# EAGLE design 403_led_bar (EAGLE 7.6.0)
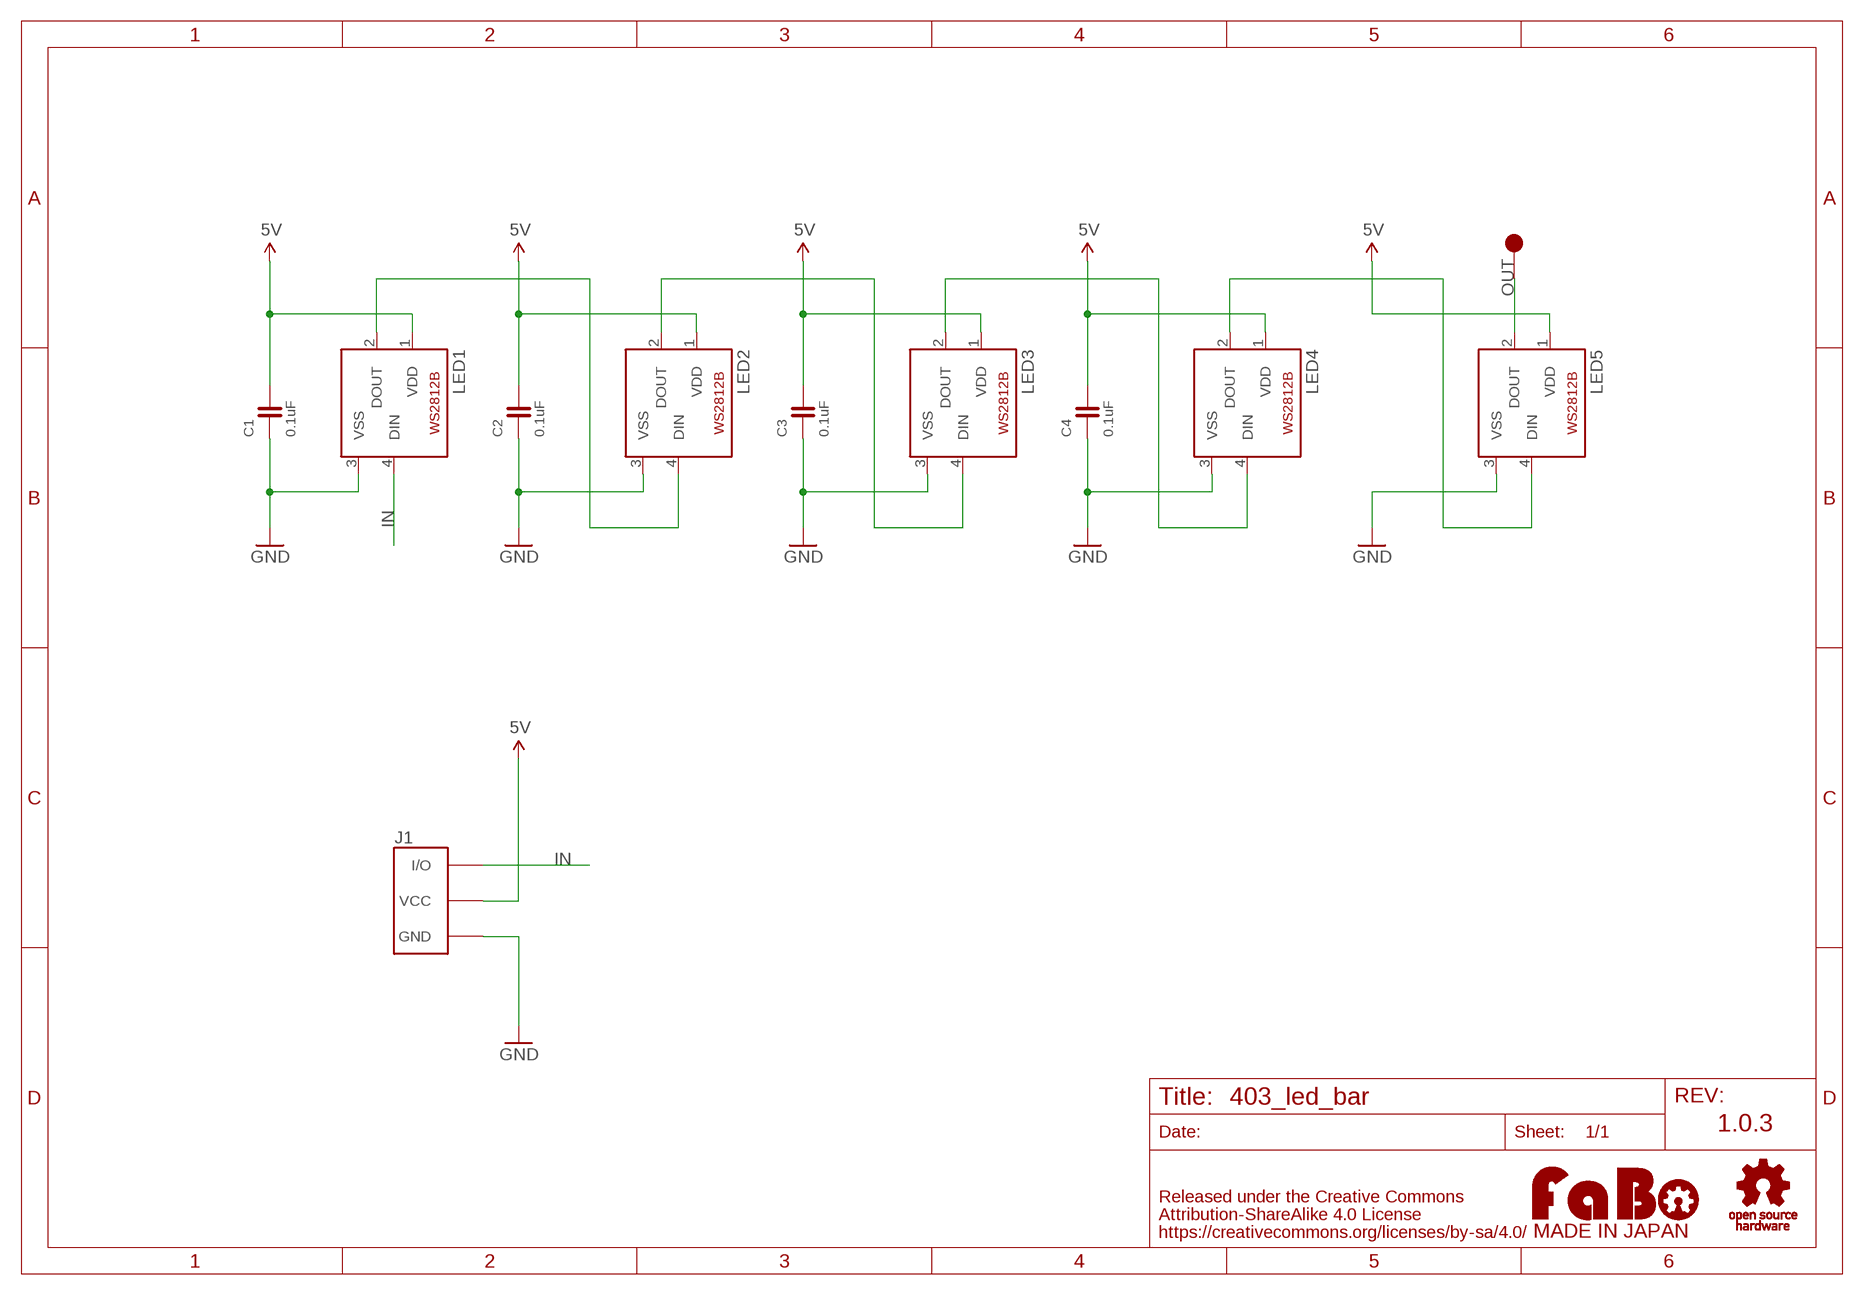
[diagram p0: schematic, sheet 1]

## Parts
C1  0.1uF  CAPACITOR-0603  [0603]
C2  0.1uF  CAPACITOR-0603  [0603]
C3  0.1uF  CAPACITOR-0603  [0603]
C4  0.1uF  CAPACITOR-0603  [0603]
J1  FABO_BRICK_3PIN-S03B-PASK-2_LONG  [FABO_BRICK_3PIN_S03B-PASK-2_LONG]
LED1  WS2812B  [WS2812B]
LED2  WS2812B  [WS2812B]
LED3  WS2812B  [WS2812B]
LED4  WS2812B  [WS2812B]
LED5  WS2812B  [WS2812B]
TP1  TP-10  [TP-10]
U$2  LOGO_OSHW-M_BOTTOM  [LOGO_OSHW_M_BOTTOM]
U$3  LOGO_FABO-M  [LOGO_FABO_MS]

## Nets
5V: C1.2 C2.2 C3.2 C4.2 J1.VCC LED1.1(VDD) LED2.1(VDD) LED3.1(VDD) LED4.1(VDD) LED5.1(VDD)
GND: C1.1 C2.1 C3.1 C4.1 J1.GND LED1.3(VSS) LED2.3(VSS) LED3.3(VSS) LED4.3(VSS) LED5.3(VSS)
IN: J1.I/O LED1.4(DIN)
N$1: LED2.2(DOUT) LED3.4(DIN)
N$4: LED3.2(DOUT) LED4.4(DIN)
N$5: LED1.2(DOUT) LED2.4(DIN)
N$7: LED4.2(DOUT) LED5.4(DIN)
OUT: LED5.2(DOUT) TP1.1

## Notes on the sheet
- 1.0.3

## Library data of the parts
C1-C4 = FaBo-Capacitor:CAPACITOR: CAPACITOR
J1 = FaBo-Template:FABO_BRICK_3PIN: FaBo Brick 3pin
LED1-LED5 = FaBo-LED:WS2812B
TP1 = FaBo-Supply:TP
U$2 = FaBo-etc:LOGO_OSHW
U$3 = FaBo-etc:LOGO_FABO

## Board
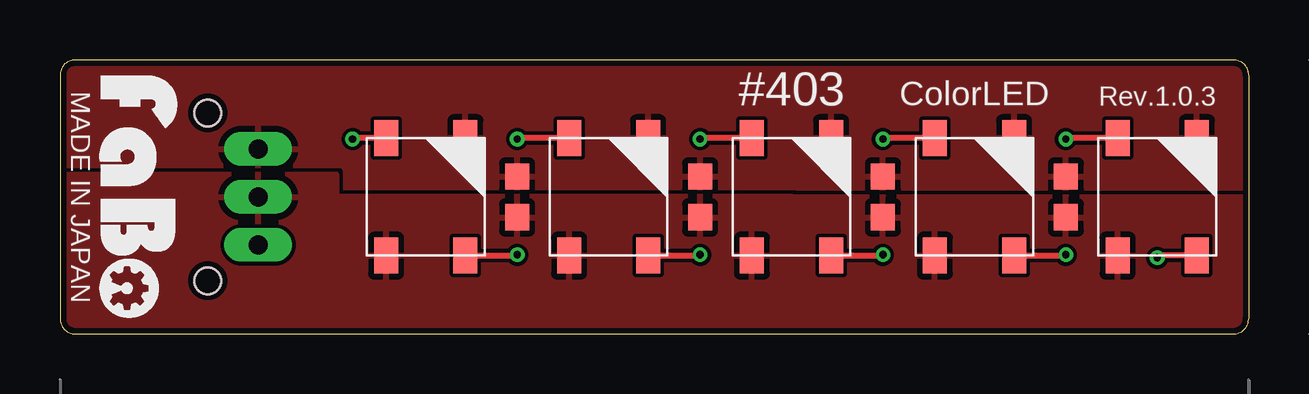
[diagram p1: board, top side]
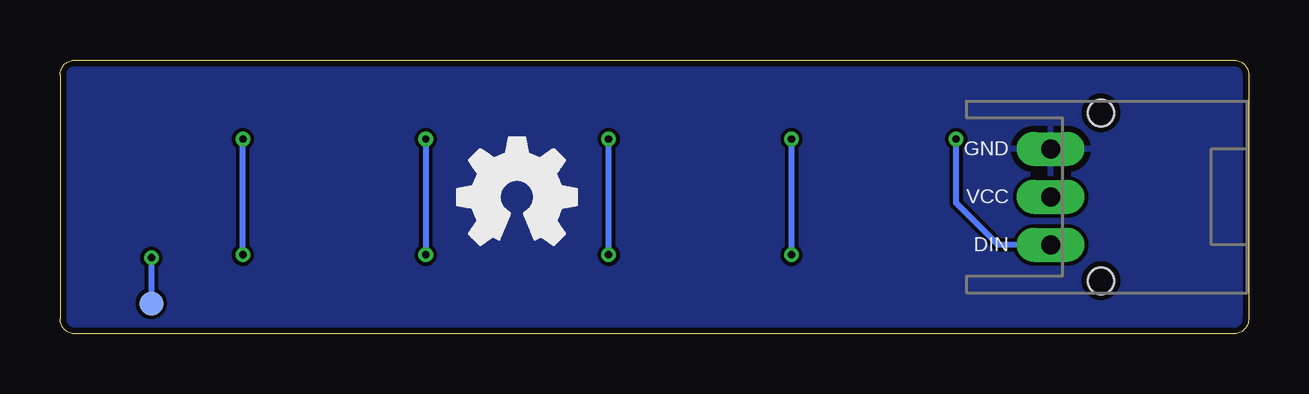
[diagram p2: board, bottom side, seen from below]

Size 49.53 x 11.43 mm. Coordinates in mm from the lower left corner, seen from the top.
Outline: 0.64,0 48.9,0 arc90 49.53,0.64 49.53,10.79 arc90 48.9,11.43 0.64,11.43 arc90 0,10.79 0,0.64 arc90 0.64,0
Copper layers (1*16): Top 0.035mm / dielectric 1.5mm / Bottom 0.035mm
Design rules "SeeedStudio_2layer_DRU_no_angle_20140221": minimum track width 6mil, minimum drill 12mil, track to track 6mil, track to pad 6mil, pad to pad 6mil, via to via 6mil, smd to smd 0mil, copper to edge 10mil, drill to drill 10mil, minimum pad ring 10mil, minimum via ring 6mil, stop-mask expansion 2mil, vias tented up to drill 100mil, thermal gap 10mil

### Footprints (pad centres in the part's own frame; a part is rotated, then mirrored left to right if it is on the bottom)
0603 = smd 1.1 x 1: 1 -0.85,0; 2 0.85,0
FABO_BRICK_3PIN_S03B-PASK-2_LONG = drill 0.8 pad 1.422 long: GND -2,0; I/O 2,0; VCC 0,0 | hole 1.1: 3.5,2.1; -3.5,2.1
WS2812B = smd 1.5 x 1: 1 -2.45,1.65; 2 -2.45,-1.65; 3 2.45,-1.65; 4 2.45,1.65
TP-10 = smd 1 x 1: 1 0,0

### Placement (x,y rotation side)
C1  19.05,5.71 270 top
C2  26.67,5.71 270 top
C3  34.29,5.71 270 top
C4  41.91,5.71 270 top
J1  8.26,5.71 270 bottom
LED1  15.24,5.71 90 top
LED2  22.86,5.71 90 top
LED3  30.48,5.71 90 top
LED4  38.1,5.71 90 top
LED5  45.72,5.71 90 top
TP1  45.72,1.27 0 bottom
U$2  30.48,5.71 0 top
U$3  1.27,5.71 270 top

### Tracks (layer width: path | path; a pad name or v marks a point on that pad's centre or on a via)
5V
  pour Top: 0,6.66 11.5,6.66 11.5,5.75 49.53,5.71 49.53,0 0,0
GND
  pour Top (rank 2): 0,11.43 49.53,11.43 49.53,5.71 11.5,5.75 11.5,6.66 0,6.66
  pour Bottom: 0,0 49.53,0 49.53,11.43 0,11.43
IN  (via drill 0.3)
  Top 0.254: LED1.4 12.23,8.16 v12.19,8.13
  Bottom 0.254: J1.I/O 10.45,3.71 12.19,5.46 v12.19,8.13
N$1  (via drill 0.3)
  Top 0.254: LED2.2 26.63,3.27 v26.67,3.3 | LED3.4 26.71,8.16 v26.67,8.13
  Bottom 0.254: v26.67,3.3 v26.67,8.13
N$4  (via drill 0.3)
  Top 0.254: LED3.2 34.25,3.27 v34.29,3.3 | LED4.4 34.33,8.16 v34.29,8.13
  Bottom 0.254: v34.29,8.13 v34.29,3.3
N$5  (via drill 0.3)
  Top 0.254: LED1.2 19.01,3.27 v19.05,3.3 | LED2.4 19.09,8.16 v19.05,8.13
  Bottom 0.254: v19.05,3.3 v19.05,8.13
N$7  (via drill 0.3)
  Top 0.254: LED4.2 41.87,3.27 v41.91,3.3 | LED5.4 41.95,8.16 v41.91,8.13
  Bottom 0.254: v41.91,3.3 v41.91,8.13
OUT  (via drill 0.3)
  Top 0.254: LED5.2 45.81,3.27 v45.72,3.17
  Bottom 0.254: v45.72,3.17 TP1.1

### Text on the board
tPlace: #403 | ColorLED | Rev.1.0.3 | MADE IN JAPAN
bPlace: GND | VCC | DIN